# Altium schematic sheet Power_Supply.SchDoc
size A4; SheetNumber: 11; SheetTotal: 12
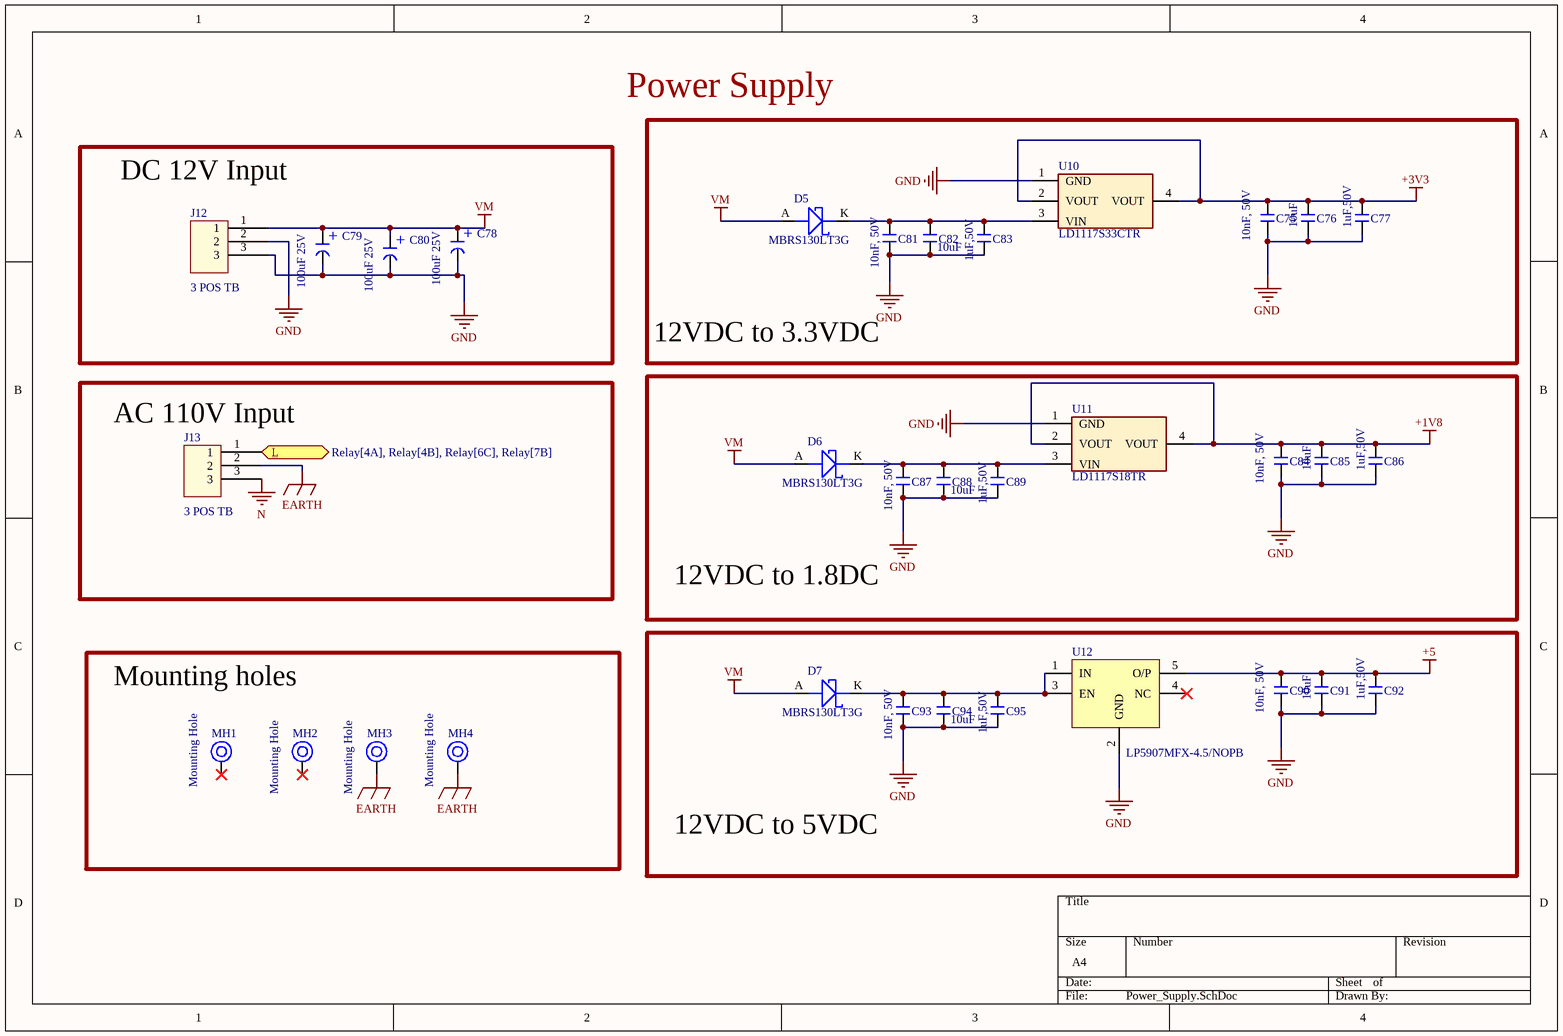
[diagram p0: Power_Supply.SchDoc]

## Parts
C75  10nF, 50V  [Capacitor_0805]
C76  10uF  [Capacitor_1206_SMD]
C77  1uF,50V  [Capacitor_0805]
C78  100uF 25V  [Capacitor_Radial_SMD_6.3mm_Dia]
C79  100uF 25V  [Capacitor_Radial_SMD_6.3mm_Dia]
C80  100uF 25V  [Capacitor_Radial_SMD_6.3mm_Dia]
C81  10nF, 50V  [Capacitor_0805]
C82  10uF  [Capacitor_1206_SMD]
C83  1uF,50V  [Capacitor_0805]
C84  10nF, 50V  [Capacitor_0805]
C85  10uF  [Capacitor_1206_SMD]
C86  1uF,50V  [Capacitor_0805]
C87  10nF, 50V  [Capacitor_0805]
C88  10uF  [Capacitor_1206_SMD]
C89  1uF,50V  [Capacitor_0805]
C90  10nF, 50V  [Capacitor_0805]
C91  10uF  [Capacitor_1206_SMD]
C92  1uF,50V  [Capacitor_0805]
C93  10nF, 50V  [Capacitor_0805]
C94  10uF  [Capacitor_1206_SMD]
C95  1uF,50V  [Capacitor_0805]
D5  MBRS130LT3G  [DIO_SMB_DO-214AA]
D6  MBRS130LT3G  [DIO_SMB_DO-214AA]
D7  MBRS130LT3G  [DIO_SMB_DO-214AA]
J12  3 POS TB  [CON3_P196_691101710003_TH_ST]
J13  3 POS TB  [CON3_P196_691101710003_TH_ST]
MH1  Mounting Hole  [MOUNTING]
MH2  Mounting Hole  [MOUNTING]
MH3  Mounting Hole  [MOUNTING]
MH4  Mounting Hole  [MOUNTING]
U10  LD1117S33CTR  [SOT-223]
U11  LD1117S18TR  [SOT-223]
U12  LP5907MFX-4.5/NOPB  [SOT23-5]

## Blocks framed on the sheet
12VDC to 3.3VDC: C75-C77 C81-C83 D5 U10
DC 12V Input: C78-C80 J12
AC 110V Input: J13
12VDC to 1.8DC: C84-C89 D6 U11
Mounting holes: MH1-MH4
12VDC to 5VDC: C90-C95 D7 U12

## Ports
L (bidir, see Relay[4A], Relay[4B], Relay[6C], Relay[7B])

## Nets
+1V8: C84.2 C85.2 C86.2 U11.2(VOUT) U11.4(VOUT)
+3V3: C75.2 C76.2 C77.2 U10.2(VOUT) U10.4(VOUT)
+5: C90.2 C91.2 C92.2 U12.5(O/P)
EARTH: J13.2 MH3.1 MH4.1
GND: C75.1 C76.1 C77.1 C78.2 C79.2 C80.2 C81.1 C82.1 C83.1 C84.1 C85.1 C86.1 C87.1 C88.1 C89.1 C90.1 C91.1 C92.1 C93.1 C94.1 C95.1 J12.2 J12.3 U10.1(GND) U11.1(GND) U12.2(GND)
N: J13.3
VM: C78.1 C79.1 C80.1 D5.A D6.A D7.A J12.1
L: J13.1 ; port L
NetC81_2: C81.2 C82.2 C83.2 D5.K U10.3(VIN)
NetC87_2: C87.2 C88.2 C89.2 D6.K U11.3(VIN)
NetC93_2: C93.2 C94.2 C95.2 D7.K U12.1(IN) U12.3(EN)

Not connected (* = marked no-connect by the designer): MH1 1*; MH2 1*; U12 4(NC)*

## Notes on the sheet
- Power Supply
- (in symbol CAP_100uF_25V_Alum) +

## Library data of the parts
C75 C81 C84 C87 C90 C93 = Cap_10nF_0805: Multilayer Ceramic Capacitors MLCC - SMD/SMT 50V 0.01uF X7R 0805 10% AEC-Q200; Manufacturer: KEMET; Manufacturer Part Number: C0805C103K5RECAUTO; Dielectric: 1511DielectricType; Supplier: Arrow Electronics; Supplier Part Number: C0805C103K5RECAUTO; RoHS: Yes; Category: Ceramic Capacitors; Stock: 16; Pricing: 1=0,22, 10=0,0376 (USD); Voltage Rating (DC): 50V; ComponentLink1URL: http://www.farnell.com/datasheets/2723804.pdf?src-supplier=Farnell; ComponentLink1Description: http://www.farnell.com/datasheets/2723804.pdf?src-supplier=Farnell; ComponentLink2URL: https://api.kemet.com/component-edge/download/datasheet/C0805C103K5RECAUTO.pdf?src-supplier=Digikey; ComponentLink2Description: https://api.kemet.com/component-edge/download/datasheet/C0805C103K5RECAUTO.pdf?src-supplier=Digikey; ComponentLink3URL: http://www.farnell.com/datasheets/2723804.pdf?src-supplier=Newark; ComponentLink3Description: http://www.farnell.com/datasheets/2723804.pdf?src-supplier=Newark
C76 C82 C85 C88 C91 C94 = Cap_10uF_1206: Multilayer Ceramic Capacitor, 10 uF, 50 V, ï¿½ 10%, X7R, 1206 [3216 Metric]; Manufacturer: Samsung; Manufacturer Part Number: CL31B106KBHNNNE; Voltage Rating (DC): 50V; Supplier: Digikey; Supplier Part Number: 1276-6767-1-ND; RoHS: Yes; Category: Ceramic Capacitors; Stock: 207136; Pricing: 1=0,25, 10=0,15, 100=0,1008, 1000=0,0728 (USD); Mounting Technology: Surface Mount; Case/Package: 1206; Case Code (Metric): 3216; Case Code (Imperial): 1206; Material: Ceramic; Min Operating Temperature: -55°C; Max Operating Temperature: 125°C; Value: 10uF; Tolerance: 10%; Dielectric: X7R; Packaging: Cut Tape; Voltage Rating: 50V; Series: CL; Height: 1.8mm; Lead Free: Lead Free; RoHS Compliant: Yes; ComponentLink1URL: https://datasheet.octopart.com/CL31B106KBHNNNE-Samsung-Electro-Mechanics-datasheet-149066874.pdf?src-supplier=Future+Electronics; ComponentLink1Description: https://datasheet.octopart.com/CL31B106KBHNNNE-Samsung-Electro-Mechanics-datasheet-149066874.pdf?src-supplier=Future+Electronics; ComponentLink2URL: http://www.samsungsem.com/kr/support/product-search/mlcc/CL31B106KBHNNNE.jsp?src-supplier=Digikey; ComponentLink2Description: http://www.samsungsem.com/kr/support/product-search/mlcc/CL31B106KBHNNNE.jsp?src-supplier=Digikey; ComponentLink3URL: https://datasheet.octopart.com/CL31B106KBHNNNE-Samsung-Electro-Mechanics-datasheet-137256395.pdf?src-supplier=Farnell; ComponentLink3Description: https://datasheet.octopart.com/CL31B106KBHNNNE-Samsung-Electro-Mechanics-datasheet-137256395.pdf?src-supplier=Farnell; ComponentLink4URL: https://datasheet.octopart.com/CL31B106KBHNNNE-Samsung-Electro-Mechanics-datasheet-110617700.pdf?src-supplier=LCSC; ComponentLink4Description: https://datasheet.octopart.com/CL31B106KBHNNNE-Samsung-Electro-Mechanics-datasheet-110617700.pdf?src-supplier=LCSC
C77 C83 C86 C89 C92 C95 = Cap_1uF_0805: 0805 1 uF 50 V ±5 % Tolerance X7R Surface Mount Multilayer Ceramic Capacitor; Manufacturer: Yageo; Manufacturer Part Number: CC0805JKX7R9BB105; Material: 4241ConductorMaterial; Dielectric: 1511DielectricType; Supplier: Digikey; Supplier Part Number: 311-3498-1-ND; RoHS: Yes; Category: Ceramic Capacitors; Stock: 30160; Pricing: 1=0,29, 10=0,168, 100=0,1077, 1000=0,07673 (USD); Voltage Rating (DC): 50V; Height: 1.45mm; Lead Free: 5697LeadFree; Halogen Free: 5694HalogenFree; ComponentLink1URL: https://datasheet.octopart.com/CC0805JKX7R9BB105-Yageo-datasheet-137700082.pdf?src-supplier=Future+Electronics; ComponentLink1Description: https://datasheet.octopart.com/CC0805JKX7R9BB105-Yageo-datasheet-137700082.pdf?src-supplier=Future+Electronics; ComponentLink2URL: http://www.yageo.com/documents/recent/UPY-GPHC_X7R_6.3V-to-50V_18.pdf?src-supplier=Digikey; ComponentLink2Description: http://www.yageo.com/documents/recent/UPY-GPHC_X7R_6.3V-to-50V_18.pdf?src-supplier=Digikey; ComponentLink3URL: https://datasheet.octopart.com/CC0805JKX7R9BB105-Yageo-datasheet-151948686.pdf?src-supplier=Farnell; ComponentLink3Description: https://datasheet.octopart.com/CC0805JKX7R9BB105-Yageo-datasheet-151948686.pdf?src-supplier=Farnell
C78-C80 = CAP_100uF_25V_Alum: Radial Can - SMD ALUMINUM ELECTROLYTIC CAPACITOR UWT 25V 100muF ±20% 0.248Dia 6.30mm; Manufacturer: Nichicon; Manufacturer Part Number: UWT1E101MCL1GS; Dielectric Material: 158ConductorMaterial; Polarity: 5066Direction; Supplier: Digikey; Supplier Part Number: 493-2190-1-ND; RoHS: Yes; Category: Aluminum Electrolytic Capacitors; Stock: 63623; Pricing: 1=0,39, 10=0,257, 50=0,1994, 100=0,1803, 900=0,13583, 1800=0,12559, 2700=0,12025, 4500=0,11412, 6300=0,11042, 9000=0,10676, 22500=0,09846, 45000=0,09311, 90000=0,08845 (USD); Lead Free: 5697LeadFree; ComponentLink1URL: https://datasheet.ciiva.com/11776/0900766b80fa3a91-11776931.pdf?src-supplier=Rs; ComponentLink1Description: https://datasheet.ciiva.com/11776/0900766b80fa3a91-11776931.pdf?src-supplier=Rs; ComponentLink2URL: https://datasheet.ciiva.com/96/e-wt-96674.pdf?src-supplier=Digikey; ComponentLink2Description: https://datasheet.ciiva.com/96/e-wt-96674.pdf?src-supplier=Digikey; ComponentLink3URL: https://datasheet.ciiva.com/96/e-wt-96675.pdf?src-supplier=Digikey; ComponentLink3Description: https://datasheet.ciiva.com/96/e-wt-96675.pdf?src-supplier=Digikey; ComponentLink4URL: https://datasheet.ciiva.com/96/e-wt-96676.pdf?src-supplier=Digikey; ComponentLink4Description: https://datasheet.ciiva.com/96/e-wt-96676.pdf?src-supplier=Digikey; ComponentLink5URL: https://datasheet.ciiva.com/7851/e-wt-7851752.pdf?src-supplier=Element14; ComponentLink5Description: https://datasheet.ciiva.com/7851/e-wt-7851752.pdf?src-supplier=Element14
D5-D7 = DIO-S_445mV-30V-2A-SMB: Diode Schottky 30V 2A Surface Mount SMB; Manufacturer: ON Semiconductor; Alternate Part Number-1: NA; Manufacturer Part Number: MBRS130LT3G; Case/Package: SMB; Supplier-1: ARROW; Supplier Part Number-1: MBRS130LT3G
J12 J13 = CON-TB_3X1-196-ST-TH: 3 Pins, 1 Row 5mm Pitch, straight Connector, male; Manufacturer: Wurth Electronics; Manufacturer Part Number: 691101710003; Alternate Part Number-1: NA; Case/Package: TH-CON; Supplier-1: SP ROAD; Supplier Part Number-1: 691101710003
MH1-MH4 = MH_3.5H_6D: Manufacturer Part Number: NA; Case/Package: TH; Manufacturer: NA; Supplier-1: NA; Supplier Part Number-1: NA; Alternate Part Number-1: NA
U10 = REG_15V-3.3V-0.9A-12W-SOT223: Linear Voltage Regulator IC 1 Output 800mA SOT-223; Manufacturer: STMicroelectronics; Alternate Part Number-1: NA; Manufacturer Part Number: LD1117S33CTR; Case/Package: SOT223; Supplier-1: SP ROAD; Supplier Part Number-1: LD1117S33CTR
U11 = REG_15V-1.8V-0.8A-1.4W-SOT223: LDO Voltage Regulators 1.8V 0.8A Positive; Manufacturer: STMicroelectronics; Alternate Part Number-1: NA; Manufacturer Part Number: LD1117S18TR; Case/Package: SOT-223-3; Supplier-1: Mouser; Supplier Part Number-1: 511-LD1117S18-TR
U12 = REG_5.5V-4.5V-0.25A-0.8W-SOT-23-5: Linear Voltage Regulator IC 1 Output 250mA SOT-23-5; Manufacturer: STMicroelectronics; Alternate Part Number-1: NA; Manufacturer Part Number: LP5907MFX-4.5/NOPB; Case/Package: SOT-23-5; Supplier-1: SP ROAD; Supplier Part Number-1: LP5907MFX-4.5/NOPB